# Altium schematic sheet Motor_Connectors.SchDoc
size A4; SheetNumber: 5; SheetTotal: 6
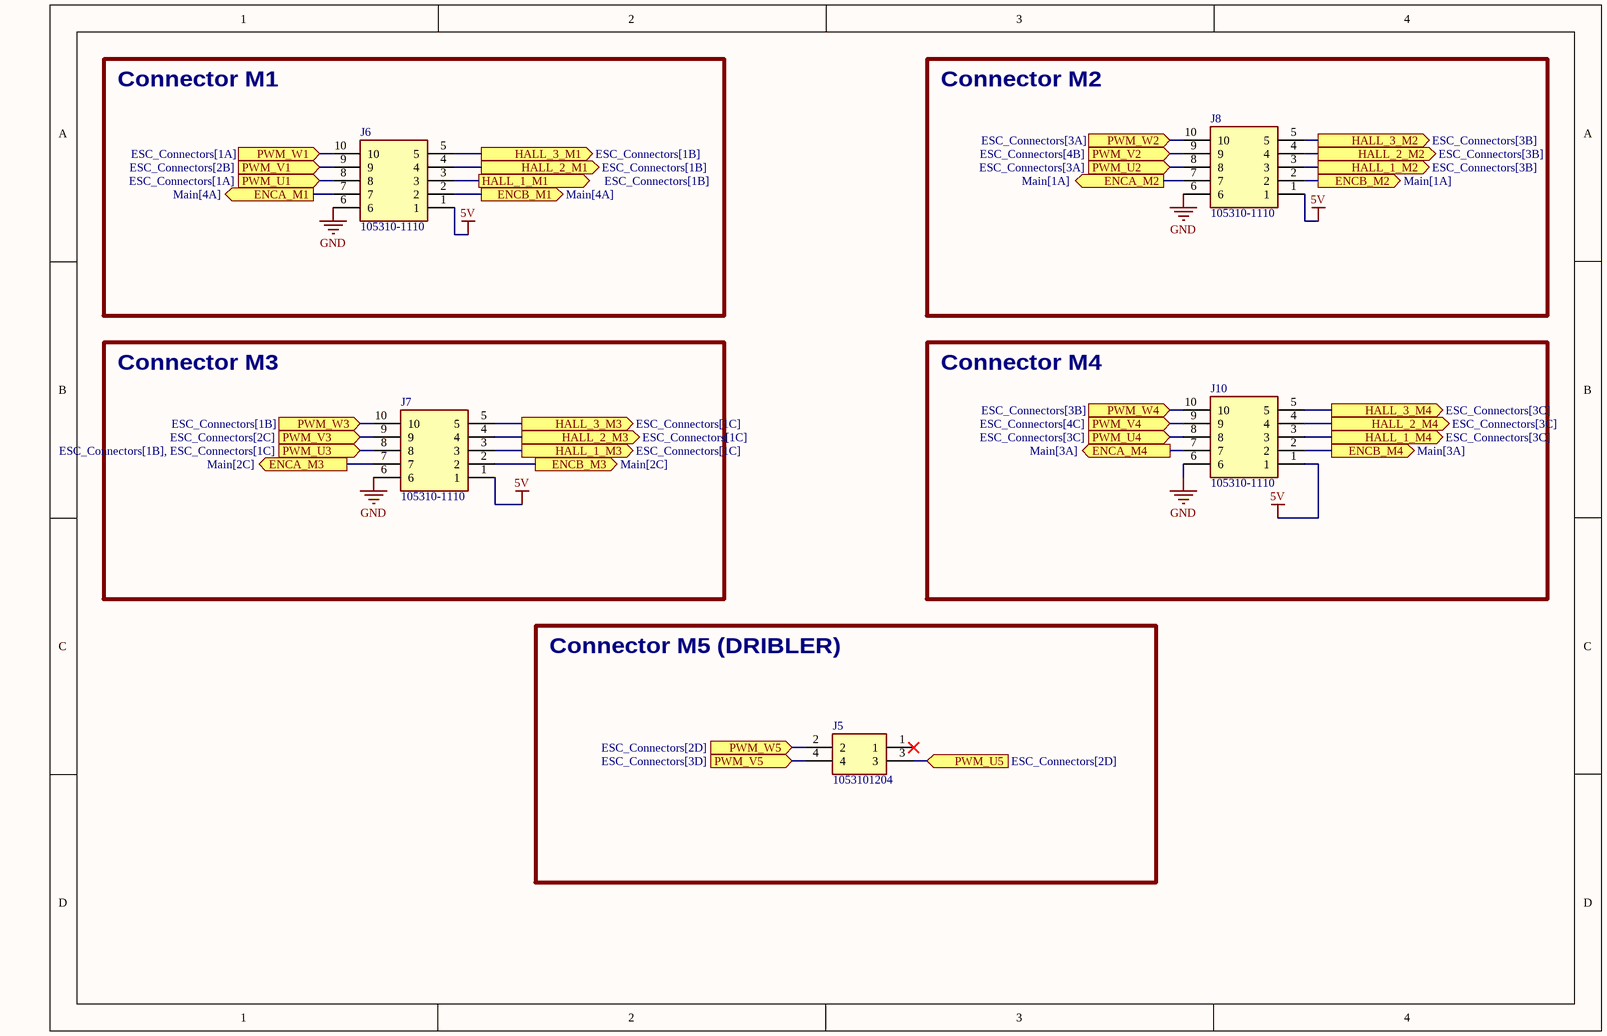
[diagram p0: Motor_Connectors.SchDoc]

## Parts
J5  1053101204  [105310YY04_3]
J6  105310-1110  [1053101110]
J7  105310-1110  [1053101110]
J8  105310-1110  [1053101110]
J10  105310-1110  [1053101110]

## Blocks framed on the sheet
Connector M1: J6
Connector M2: J8
Connector M3: J7
Connector M4: J10
Connector M5 (DRIBLER): J5

## Ports
ENCA_M1 (out, see Main[4A]), ENCA_M2 (out, see Main[1A]), ENCA_M3 (out, see Main[2C]), ENCA_M4 (out, see Main[3A]), ENCB_M1 (out, see Main[4A]), ENCB_M2 (out, see Main[1A]), ENCB_M3 (out, see Main[2C]), ENCB_M4 (out, see Main[3A]), HALL_1_M1 (out, see ESC_Connectors[1B]), HALL_1_M2 (out, see ESC_Connectors[3B]), HALL_1_M3 (out, see ESC_Connectors[1C]), HALL_1_M4 (out, see ESC_Connectors[3C]), HALL_2_M1 (out, see ESC_Connectors[1B]), HALL_2_M2 (out, see ESC_Connectors[3B]), HALL_2_M3 (out, see ESC_Connectors[1C]), HALL_2_M4 (out, see ESC_Connectors[3C]), HALL_3_M1 (out, see ESC_Connectors[1B]), HALL_3_M2 (out, see ESC_Connectors[3B]), HALL_3_M3 (out, see ESC_Connectors[1C]), HALL_3_M4 (out, see ESC_Connectors[3C]), PWM_U1 (in, see ESC_Connectors[1A]), PWM_U2 (in, see ESC_Connectors[3A]), PWM_U3 (in, see ESC_Connectors[1B], ESC_Connectors[1C]), PWM_U4 (in, see ESC_Connectors[3C]), PWM_U5 (in, see ESC_Connectors[2D]), PWM_V1 (in, see ESC_Connectors[2B]), PWM_V2 (in, see ESC_Connectors[4B]), PWM_V3 (in, see ESC_Connectors[2C]), PWM_V4 (in, see ESC_Connectors[4C]), PWM_V5 (in, see ESC_Connectors[3D]), PWM_W1 (in, see ESC_Connectors[1A]), PWM_W2 (in, see ESC_Connectors[3A]), PWM_W3 (in, see ESC_Connectors[1B]), PWM_W4 (in, see ESC_Connectors[3B]), PWM_W5 (in, see ESC_Connectors[2D])

## Nets
5V: J6.1 J7.1 J8.1 J10.1
GND: J6.6 J7.6 J8.6 J10.6
ENCA_M1: J6.7 ; port ENCA_M1
ENCA_M2: J8.7 ; port ENCA_M2
ENCA_M3: J7.7 ; port ENCA_M3
ENCA_M4: J10.7 ; port ENCA_M4
ENCB_M1: J6.2 ; port ENCB_M1
ENCB_M2: J8.2 ; port ENCB_M2
ENCB_M3: J7.2 ; port ENCB_M3
ENCB_M4: J10.2 ; port ENCB_M4
HALL_1_M1: J6.3 ; port HALL_1_M1
HALL_1_M2: J8.3 ; port HALL_1_M2
HALL_1_M3: J7.3 ; port HALL_1_M3
HALL_1_M4: J10.3 ; port HALL_1_M4
HALL_2_M1: J6.4 ; port HALL_2_M1
HALL_2_M2: J8.4 ; port HALL_2_M2
HALL_2_M3: J7.4 ; port HALL_2_M3
HALL_2_M4: J10.4 ; port HALL_2_M4
HALL_3_M1: J6.5 ; port HALL_3_M1
HALL_3_M2: J8.5 ; port HALL_3_M2
HALL_3_M3: J7.5 ; port HALL_3_M3
HALL_3_M4: J10.5 ; port HALL_3_M4
PWM_U1: J6.8 ; port PWM_U1
PWM_U2: J8.8 ; port PWM_U2
PWM_U3: J7.8 ; port PWM_U3
PWM_U4: J10.8 ; port PWM_U4
PWM_U5: J5.3 ; port PWM_U5
PWM_V1: J6.9 ; port PWM_V1
PWM_V2: J8.9 ; port PWM_V2
PWM_V3: J7.9 ; port PWM_V3
PWM_V4: J10.9 ; port PWM_V4
PWM_V5: J5.4 ; port PWM_V5
PWM_W1: J6.10 ; port PWM_W1
PWM_W2: J8.10 ; port PWM_W2
PWM_W3: J7.10 ; port PWM_W3
PWM_W4: J10.10 ; port PWM_W4
PWM_W5: J5.2 ; port PWM_W5

Not connected (* = marked no-connect by the designer): J5 1*

## Library data of the parts
J5 = 1053101204: Connector; Manufacturer_Name: Molex; Datasheet Link: https://www.molex.com/pdm_docs/sd/1053101204_sd.pdf; Height: 10.51mm; Manufacturer_Part_Number: 1053101204; Arrow Part Number: 1053101204; Arrow Price/Stock: https://www.arrow.com/en/products/1053101204/molex?region=nac
J6-J8 J10 = 105310-1110: Connector; Manufacturer_Name: Molex; Datasheet Link: https://www.molex.com/pdm_docs/sd/1053101110_sd.pdf?webSyncID=090114e7-ea8e-9787-c070-e8582bec0296&sessionGUID=771b0990-7150-0e04-30ce-34353ccdcb30; Height: 10.51mm; Manufacturer_Part_Number: 105310-1110; Mouser Part Number: 538-105310-1110; Mouser Price/Stock: https://www.mouser.co.uk/ProductDetail/Molex/105310-1110?qs=PqFvFmEiOr6xTZJaWkdhvQ%3D%3D